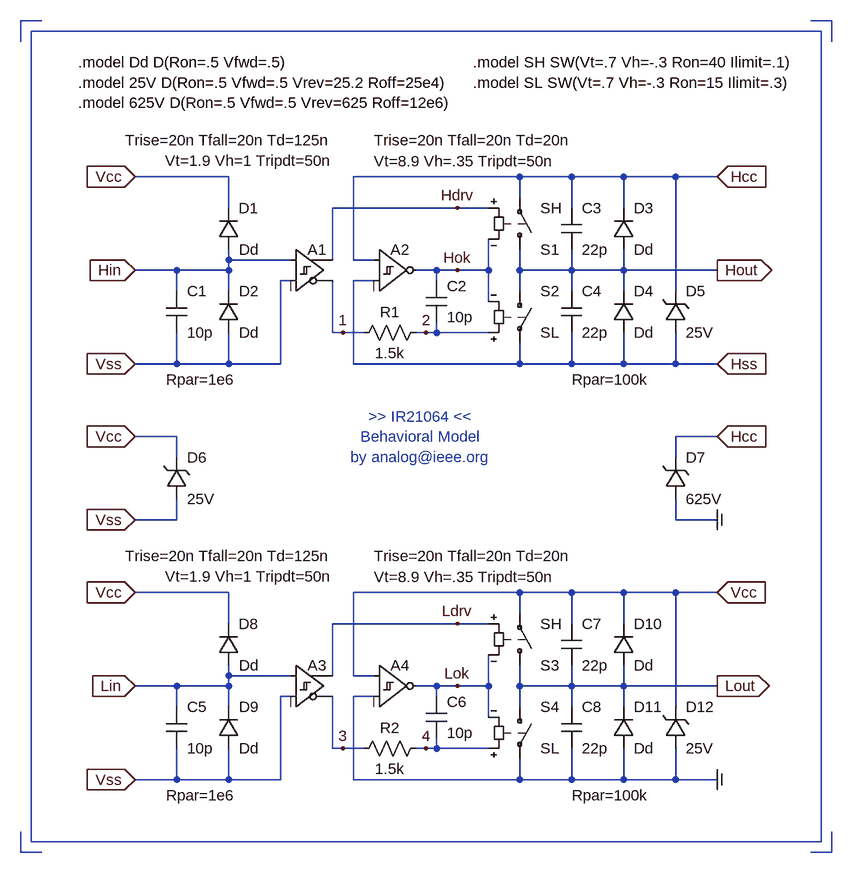
[diagram p0: schematic IR21064.asc]
IR21064.asc, the LTspice schematic file:
Version 4
SHEET 1 1792 1048
WIRE -224 -288 -160 -288
WIRE 672 -288 528 -288
WIRE -400 -640 -400 -672
WIRE -400 -672 -368 -672
WIRE -400 576 -400 608
WIRE -400 608 -368 608
WIRE 816 608 848 608
WIRE 848 608 848 576
WIRE 816 -672 848 -672
WIRE 848 -672 848 -640
WIRE -80 -288 -80 -304
WIRE -80 -384 -80 -432
WIRE -224 -432 -80 -432
WIRE -80 -256 -80 -288
WIRE 528 -432 528 -384
WIRE 528 -320 528 -288
WIRE 528 -192 528 -144
WIRE 528 -144 608 -144
WIRE 608 -144 608 -192
WIRE 608 -256 608 -432
WIRE 608 -432 528 -432
WIRE 672 -432 608 -432
WIRE 672 -144 608 -144
WIRE 528 -256 528 -288
WIRE 528 -288 448 -288
WIRE 80 -384 272 -384
WIRE 448 -432 448 -384
WIRE 448 -320 448 -288
WIRE 368 -432 448 -432
WIRE 448 -192 448 -144
WIRE 368 -144 448 -144
WIRE 448 -288 368 -288
WIRE 448 -288 448 -256
WIRE 16 -272 0 -272
WIRE 0 -272 0 -144
WIRE 368 -432 368 -400
WIRE 368 -320 368 -288
WIRE 368 -176 368 -144
WIRE 368 -288 368 -256
WIRE 240 -288 272 -288
WIRE 240 -288 240 -272
WIRE 320 -288 320 -336
WIRE 208 -192 224 -192
WIRE 240 -192 240 -208
WIRE 320 -288 320 -240
WIRE 240 -192 320 -192
WIRE 144 -304 112 -304
WIRE 112 -304 112 -432
WIRE 112 -432 368 -432
WIRE 144 -272 112 -272
WIRE 112 -272 112 -144
WIRE 112 -144 368 -144
WIRE 208 -288 240 -288
WIRE 80 -304 80 -384
WIRE 80 -272 80 -192
WIRE 80 -192 96 -192
WIRE 448 -432 528 -432
WIRE 448 -144 528 -144
WIRE 0 -144 -80 -144
WIRE -160 -144 -160 -192
WIRE 16 -304 -80 -304
WIRE -80 -304 -80 -320
WIRE -160 -256 -160 -288
WIRE -160 -288 -80 -288
WIRE -80 -192 -80 -144
WIRE -80 -144 -160 -144
WIRE 272 -288 320 -288
WIRE 272 -384 320 -384
WIRE -160 -144 -224 -144
WIRE 608 64 608 96
WIRE 608 96 672 96
WIRE 608 0 608 -32
WIRE 608 -32 672 -32
WIRE -160 64 -160 96
WIRE -160 96 -224 96
WIRE -160 0 -160 -32
WIRE -160 -32 -224 -32
WIRE -224 352 -160 352
WIRE -80 352 -80 336
WIRE -80 256 -80 208
WIRE -224 208 -80 208
WIRE -80 384 -80 352
WIRE 16 368 0 368
WIRE 0 368 0 496
WIRE 144 336 112 336
WIRE 112 336 112 208
WIRE 144 368 112 368
WIRE 112 368 112 496
WIRE 80 336 80 256
WIRE 80 368 80 448
WIRE 80 448 96 448
WIRE 0 496 -80 496
WIRE -160 496 -160 448
WIRE 16 336 -80 336
WIRE -80 336 -80 320
WIRE -160 384 -160 352
WIRE -160 352 -80 352
WIRE -80 448 -80 496
WIRE -80 496 -160 496
WIRE -160 496 -224 496
WIRE 368 208 368 240
WIRE 368 320 368 352
WIRE 368 464 368 496
WIRE 240 352 272 352
WIRE 240 352 240 368
WIRE 320 352 320 304
WIRE 208 448 224 448
WIRE 240 448 240 432
WIRE 320 352 320 400
WIRE 240 448 320 448
WIRE 112 208 368 208
WIRE 112 496 368 496
WIRE 208 352 240 352
WIRE 272 352 320 352
WIRE 272 256 320 256
WIRE 80 256 272 256
WIRE 672 352 528 352
WIRE 528 208 528 256
WIRE 528 320 528 352
WIRE 528 448 528 496
WIRE 528 496 608 496
WIRE 608 496 608 448
WIRE 608 384 608 208
WIRE 608 208 528 208
WIRE 672 208 608 208
WIRE 672 496 608 496
WIRE 528 384 528 352
WIRE 528 352 448 352
WIRE 448 208 448 256
WIRE 448 320 448 352
WIRE 368 208 448 208
WIRE 448 448 448 496
WIRE 368 496 448 496
WIRE 448 352 368 352
WIRE 448 352 448 384
WIRE 448 208 528 208
WIRE 448 496 528 496
WIRE 368 352 368 384
WIRE 96 -192 128 -192
WIRE 224 -192 240 -192
WIRE 96 448 128 448
WIRE 224 448 240 448
FLAG 672 -288 Hout
IOPIN 672 -288 Out
FLAG -224 -288 Hin
IOPIN -224 -288 In
FLAG -224 -432 Vcc
IOPIN -224 -432 In
FLAG 672 -432 Hcc
IOPIN 672 -432 In
FLAG 672 -144 Hss
IOPIN 672 -144 In
FLAG 272 -384 Hdrv
FLAG 272 -288 Hok
FLAG 672 -32 Hcc
IOPIN 672 -32 In
FLAG -224 -144 Vss
IOPIN -224 -144 In
FLAG 672 96 Com
IOPIN 672 96 In
FLAG -224 -32 Vcc
IOPIN -224 -32 In
FLAG -224 96 Vss
IOPIN -224 96 In
FLAG -224 352 Lin
IOPIN -224 352 In
FLAG -224 208 Vcc
IOPIN -224 208 In
FLAG -224 496 Vss
IOPIN -224 496 In
FLAG 272 256 Ldrv
FLAG 272 352 Lok
FLAG 672 208 Vcc
IOPIN 672 208 In
FLAG 672 496 Com
IOPIN 672 496 In
FLAG 672 352 Lout
IOPIN 672 352 Out
FLAG 96 -192 1
FLAG 224 -192 2
FLAG 96 448 3
FLAG 224 448 4
SYMBOL diode -96 -320 M180
WINDOW 0 31 64 Left 0
WINDOW 3 32 0 Left 0
SYMATTR InstName D1
SYMATTR Value Dd
SYMBOL diode -96 -192 M180
WINDOW 0 32 64 Left 0
WINDOW 3 32 0 Left 0
SYMATTR InstName D2
SYMATTR Value Dd
SYMBOL diode 512 -320 M180
WINDOW 0 32 64 Left 0
WINDOW 3 32 0 Left 0
SYMATTR InstName D3
SYMATTR Value Dd
SYMBOL diode 512 -192 M180
WINDOW 0 32 64 Left 0
WINDOW 3 32 0 Left 0
SYMATTR InstName D4
SYMATTR Value Dd
SYMBOL zener 592 -192 M180
WINDOW 0 32 64 Left 0
WINDOW 3 32 0 Left 0
SYMATTR InstName D5
SYMATTR Value 25V
SYMBOL cap 432 -384 R0
WINDOW 0 32 0 Left 0
WINDOW 3 32 64 Left 0
SYMATTR InstName C3
SYMATTR Value 22p
SYMBOL cap 432 -256 R0
WINDOW 0 32 0 Left 0
WINDOW 3 32 64 Left 0
WINDOW 39 16 136 Left 0
SYMATTR InstName C4
SYMATTR Value 22p
SYMATTR SpiceLine Rpar=100k
SYMBOL sw 368 -304 M180
WINDOW 0 32 16 Left 0
WINDOW 3 32 80 Left 0
SYMATTR InstName S1
SYMATTR Value SH
SYMBOL sw 368 -272 R0
WINDOW 0 32 16 Left 0
WINDOW 3 32 80 Left 0
SYMATTR InstName S2
SYMATTR Value SL
SYMBOL Digital\\diffschmitt 16 -352 R0
WINDOW 0 40 32 Center 0
WINDOW 3 64 -136 Right 0
WINDOW 123 64 -105 Right 0
SYMATTR InstName A1
SYMATTR Value Trise=20n Tfall=20n Td=125n
SYMATTR Value2 Vt=1.9 Vh=1 Tripdt=50n
SYMBOL cap 224 -272 R0
WINDOW 3 32 56 Left 0
WINDOW 0 32 8 Left 0
SYMATTR Value 10p
SYMATTR InstName C2
SYMBOL res 224 -208 R90
WINDOW 0 0 56 VBottom 0
WINDOW 3 32 56 VTop 0
SYMATTR InstName R1
SYMATTR Value 1.5k
SYMBOL Digital\\diffschmtinv 144 -352 R0
WINDOW 0 40 32 Center 0
WINDOW 3 0 -136 Left 0
WINDOW 123 0 -104 Left 0
SYMATTR InstName A2
SYMATTR Value Trise=20n Tfall=20n Td=20n
SYMATTR Value2 Vt=8.9 Vh=.35 Tripdt=50n
SYMBOL cap -176 -256 R0
WINDOW 0 32 0 Left 0
WINDOW 3 32 64 Left 0
WINDOW 39 0 136 Left 0
SYMATTR InstName C1
SYMATTR Value 10p
SYMATTR SpiceLine Rpar=1e6
SYMBOL zener 592 64 M180
WINDOW 0 32 64 Left 0
WINDOW 3 32 0 Left 0
SYMATTR InstName D7
SYMATTR Value 625V
SYMBOL zener -176 64 M180
WINDOW 0 32 64 Left 0
WINDOW 3 32 0 Left 0
SYMATTR InstName D6
SYMATTR Value 25V
SYMBOL diode -96 320 M180
WINDOW 0 31 64 Left 0
WINDOW 3 32 0 Left 0
SYMATTR InstName D8
SYMATTR Value Dd
SYMBOL diode -96 448 M180
WINDOW 0 32 64 Left 0
WINDOW 3 32 0 Left 0
SYMATTR InstName D9
SYMATTR Value Dd
SYMBOL Digital\\diffschmitt 16 288 R0
WINDOW 0 40 32 Center 0
WINDOW 3 64 -136 Right 0
WINDOW 123 64 -105 Right 0
SYMATTR InstName A3
SYMATTR Value Trise=20n Tfall=20n Td=125n
SYMATTR Value2 Vt=1.9 Vh=1 Tripdt=50n
SYMBOL res 224 432 R90
WINDOW 0 0 56 VBottom 0
WINDOW 3 32 56 VTop 0
SYMATTR InstName R2
SYMATTR Value 1.5k
SYMBOL Digital\\diffschmtinv 144 288 R0
WINDOW 0 40 32 Center 0
WINDOW 3 0 -136 Left 0
WINDOW 123 0 -104 Left 0
SYMATTR InstName A4
SYMATTR Value Trise=20n Tfall=20n Td=20n
SYMATTR Value2 Vt=8.9 Vh=.35 Tripdt=50n
SYMBOL cap -176 384 R0
WINDOW 0 32 0 Left 0
WINDOW 3 32 64 Left 0
WINDOW 39 0 136 Left 0
SYMATTR InstName C5
SYMATTR Value 10p
SYMATTR SpiceLine Rpar=1e6
SYMBOL sw 368 336 M180
WINDOW 0 32 16 Left 0
WINDOW 3 32 80 Left 0
SYMATTR InstName S3
SYMATTR Value SH
SYMBOL sw 368 368 R0
WINDOW 0 32 16 Left 0
WINDOW 3 32 80 Left 0
SYMATTR InstName S4
SYMATTR Value SL
SYMBOL cap 224 368 R0
WINDOW 3 32 56 Left 0
WINDOW 0 32 8 Left 0
SYMATTR Value 10p
SYMATTR InstName C6
SYMBOL diode 512 320 M180
WINDOW 0 32 64 Left 0
WINDOW 3 32 0 Left 0
SYMATTR InstName D10
SYMATTR Value Dd
SYMBOL diode 512 448 M180
WINDOW 0 32 64 Left 0
WINDOW 3 32 0 Left 0
SYMATTR InstName D11
SYMATTR Value Dd
SYMBOL zener 592 448 M180
WINDOW 0 32 64 Left 0
WINDOW 3 32 0 Left 0
SYMATTR InstName D12
SYMATTR Value 25V
SYMBOL cap 432 256 R0
WINDOW 0 32 0 Left 0
WINDOW 3 32 64 Left 0
SYMATTR InstName C7
SYMATTR Value 22p
SYMBOL cap 432 384 R0
WINDOW 0 32 0 Left 0
WINDOW 3 32 64 Left 0
WINDOW 39 16 136 Left 0
SYMATTR InstName C8
SYMATTR Value 22p
SYMATTR SpiceLine Rpar=100k
TEXT 216 -32 Center 0 ;>> IR21064 <<\nBehavioral Model\nby analog@ieee.org
TEXT -312 -608 Left 0 !.model Dd D(Ron=.5 Vfwd=.5)\n.model 25V D(Ron=.5 Vfwd=.5 Vrev=25.2 Roff=25e4)\n.model 625V D(Ron=.5 Vfwd=.5 Vrev=625 Roff=12e6)
TEXT 296 -608 Left 0 !.model SH SW(Vt=.7 Vh=-.3 Ron=40 Ilimit=.1)\n.model SL SW(Vt=.7 Vh=-.3 Ron=15 Ilimit=.3)
RECTANGLE Normal 832 592 -384 -656

The netlist it stands for:
* IR21064.asc
D1 Hin Vcc Dd
D2 Vss Hin Dd
D3 Hout Hcc Dd
D4 Hss Hout Dd
D5 Hss Hcc 25V
C3 Hcc Hout 22p
C4 Hout Hss 22p Rpar=100k
S1 Hout Hcc Hdrv Hok SH
S2 Hout Hss 2 Hok SL
A1 Hin Vss 0 0 0 1 Hdrv 0 SCHMITT Trise=20n Tfall=20n Td=125n Vt=1.9 Vh=1 Tripdt=50n
C2 Hok 2 10p
R1 2 1 1.5k
A2 Hcc Hss 0 0 0 Hok 0 0 SCHMITT Trise=20n Tfall=20n Td=20n Vt=8.9 Vh=.35 Tripdt=50n
C1 Hin Vss 10p Rpar=1e6
D7 Com Hcc 625V
D6 Vss Vcc 25V
D8 Lin Vcc Dd
D9 Vss Lin Dd
A3 Lin Vss 0 0 0 3 Ldrv 0 SCHMITT Trise=20n Tfall=20n Td=125n Vt=1.9 Vh=1 Tripdt=50n
R2 4 3 1.5k
A4 Vcc Com 0 0 0 Lok 0 0 SCHMITT Trise=20n Tfall=20n Td=20n Vt=8.9 Vh=.35 Tripdt=50n
C5 Lin Vss 10p Rpar=1e6
S3 Lout Vcc Ldrv Lok SH
S4 Lout Com 4 Lok SL
C6 Lok 4 10p
D10 Lout Vcc Dd
D11 Com Lout Dd
D12 Com Vcc 25V
C7 Vcc Lout 22p
C8 Lout Com 22p Rpar=100k
.model D D
.lib standard.dio
* >> IR21064 <<
* Behavioral Model
* by analog@ieee.org
.model Dd D(Ron=.5 Vfwd=.5)
.model 25V D(Ron=.5 Vfwd=.5 Vrev=25.2 Roff=25e4)
.model 625V D(Ron=.5 Vfwd=.5 Vrev=625 Roff=12e6)
.model SH SW(Vt=.7 Vh=-.3 Ron=40 Ilimit=.1)
.model SL SW(Vt=.7 Vh=-.3 Ron=15 Ilimit=.3)
.backanno
.end